# Altium schematic sheet FT230.SchDoc
size 297 x 209 mm
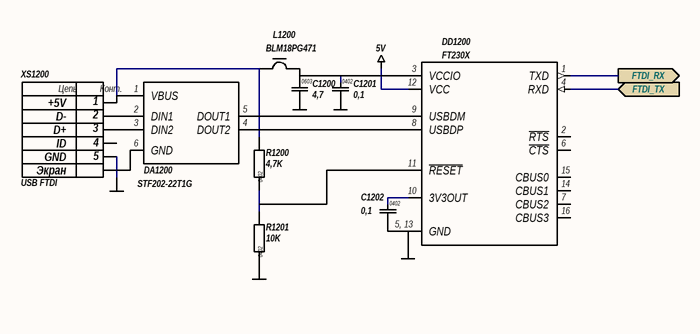
[diagram p0: FT230.SchDoc]

## Parts
C1200  4,7  [CAP0603]
C1201  0,1  [CAP0402]
C1202  0,1  [CAP0402]
DA1200  STF202-22T1G  [SOT23-6]
DD1200  FT230X  [SSOP16-4.4]
L1200  BLM18PG471  [FB0603]
R1200  4,7K  [RES0402]
R1201  10K  [RES0402]
XS1200  USB FTDI  [USBmini]

## Ports
FTDI_RX (out), FTDI_TX (in)

## Nets
5V: C1200.1 C1201.1 DD1200.3(VCCIO) DD1200.12(VCC) L1200.1
GND: C1200.2 C1201.2 C1202.2 DA1200.6(GND) DD1200.5(GND) DD1200.13(GND) R1201.1 XS1200.0(Экран) XS1200.5(GND)
FTDI_RX: DD1200.1(TXD) ; port FTDI_RX
FTDI_TX: DD1200.4(RXD) ; port FTDI_TX
NetC1202_1: C1202.1 DD1200.10(3V3OUT)
NetDA1200_1: DA1200.1(VBUS) L1200.2 R1200.2 XS1200.1(+5V)
NetDA1200_2: DA1200.2(DIN1) XS1200.2(D-)
NetDA1200_3: DA1200.3(DIN2) XS1200.3(D+)
NetDA1200_4: DA1200.4(DOUT2) DD1200.8(USBDP)
NetDA1200_5: DA1200.5(DOUT1) DD1200.9(USBDM)
NetDD1200_11: DD1200.11(~{RESET}) R1200.1 R1201.2

Not connected (* = marked no-connect by the designer): DD1200 2(~{RTS}) 6(~{CTS}) 7(CBUS2) 14(CBUS1) 15(CBUS0) 16(CBUS3); XS1200 4(ID)

## Notes on the sheet
- (in symbol FT230X) 5, 13
- (in symbol USB mini) Цепь; Конт.

## Library data of the parts
C1200 = CAP_0603: Конденсатор чип; Тип корпуса: 0603; Тип монтажа: Поверхностный; Номинал: 4,7; Тип компонента: Конденсатор чип; Value: 4,7
C1201 C1202 = CAP_0402: Конденсатор чип; Тип корпуса: 0402; Тип монтажа: Поверхностный; Номинал: 0,1; Тип компонента: Конденсатор чип; Value: 0,1
DA1200 = STF202-22T1G: Интерфейс USB защита+фильтр; Производитель: ON Semiconductor; Тип монтажа: Поверхностный; Наименование: STF202-22T1G; Тип компонента: Интерфейс USB защита+фильтр; Тип корпуса: SOT23-6
DD1200 = FT230X: Интерфейс USB-UART; Производитель: FTDI; Тип корпуса: SSOP-16; Тип монтажа: Поверхностный; Наименование: FT230X; Тип компонента: Интерфейс USB-UART
L1200 = BLM18PG: Ферритовая бусина; Производитель: Murata; Тип корпуса: 0603; Тип монтажа: Поверхностный; Наименование: BLM18PG471; Тип компонента: Ферритовая бусина
R1200 R1201 = RES_0402: Резистор чип; Тип корпуса: 0402; Тип монтажа: Поверхностный; Характеристики: 0.062Вт 50В; Тип компонента: Резистор чип
  R1200: Номинал: 4,7K; Value: 4,7K
  R1201: Номинал: 10K; Value: 10K
XS1200 = USB mini: Разъем USB; Тип монтажа: Штыревой; Тип компонента: Разъем USB